# EAGLE design DevAndDemo (EAGLE 4.13)
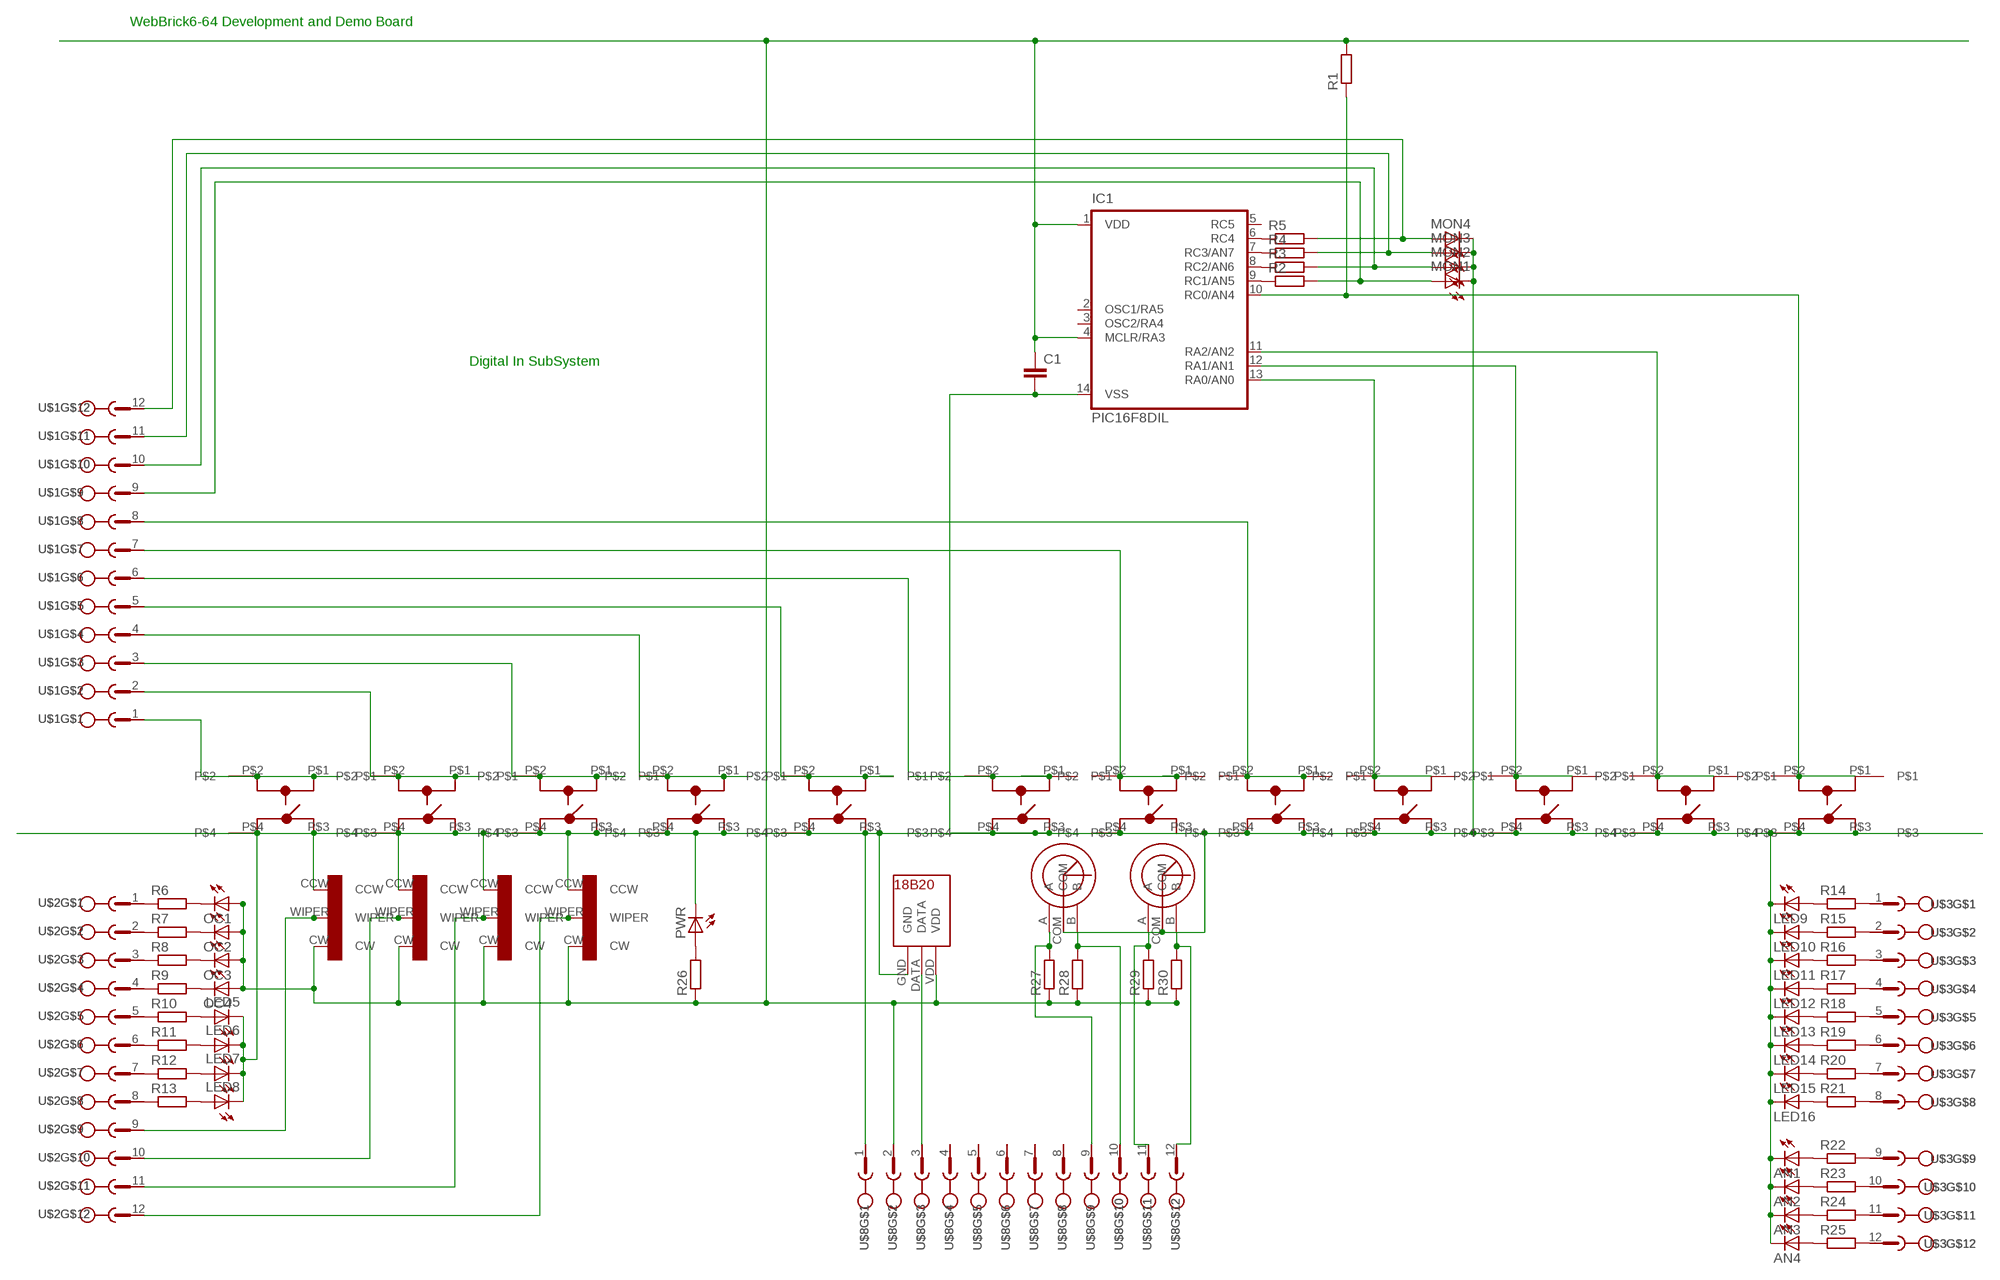
[diagram p0: schematic, sheet 1]

## Parts
AN1  LED5MM  [LED5MM]
AN2  LED5MM  [LED5MM]
AN3  LED5MM  [LED5MM]
AN4  LED5MM  [LED5MM]
ANO1  VISHAY174  [174]
ANO2  VISHAY174  [174]
ANO3  VISHAY174  [174]
ANO4  VISHAY174  [174]
C1  C-EUC1206  [C1206]
IC1  PIC16F8DIL  [DIL14]
LED5  LED5MM  [LED5MM]
LED6  LED5MM  [LED5MM]
LED7  LED5MM  [LED5MM]
LED8  LED5MM  [LED5MM]
LED9  LED5MM  [LED5MM]
LED10  LED5MM  [LED5MM]
LED11  LED5MM  [LED5MM]
LED12  LED5MM  [LED5MM]
LED13  LED5MM  [LED5MM]
LED14  LED5MM  [LED5MM]
LED15  LED5MM  [LED5MM]
LED16  LED5MM  [LED5MM]
MON1  LED5MM  [LED5MM]
MON2  LED5MM  [LED5MM]
MON3  LED5MM  [LED5MM]
MON4  LED5MM  [LED5MM]
OC1  LED5MM  [LED5MM]
OC2  LED5MM  [LED5MM]
OC3  LED5MM  [LED5MM]
OC4  LED5MM  [LED5MM]
PB1  3FSWITCH  [3F]
PB2  3FSWITCH  [3F]
PB3  3FSWITCH  [3F]
PB4  3FSWITCH  [3F]
PB5  3FSWITCH  [3F]
PB6  3FSWITCH  [3F]
PB7  3FSWITCH  [3F]
PB8  3FSWITCH  [3F]
PB9  3FSWITCH  [3F]
PB10  3FSWITCH  [3F]
PB11  3FSWITCH  [3F]
PB12  3FSWITCH  [3F]
PWR  LED5MM  [LED5MM]
R1  R-EU_M1206  [M1206]
R2  R-EU_M1206  [M1206]
R3  R-EU_M1206  [M1206]
R4  R-EU_M1206  [M1206]
R5  R-EU_M1206  [M1206]
R6  R-EU_M1206  [M1206]
R7  R-EU_M1206  [M1206]
R8  R-EU_M1206  [M1206]
R9  R-EU_M1206  [M1206]
R10  R-EU_M1206  [M1206]
R11  R-EU_M1206  [M1206]
R12  R-EU_M1206  [M1206]
R13  R-EU_M1206  [M1206]
R14  R-EU_M1206  [M1206]
R15  R-EU_M1206  [M1206]
R16  R-EU_M1206  [M1206]
R17  R-EU_M1206  [M1206]
R18  R-EU_M1206  [M1206]
R19  R-EU_M1206  [M1206]
R20  R-EU_M1206  [M1206]
R21  R-EU_M1206  [M1206]
R22  R-EU_M1206  [M1206]
R23  R-EU_M1206  [M1206]
R24  R-EU_M1206  [M1206]
R25  R-EU_M1206  [M1206]
R26  R-EU_M1206  [M1206]
R27  R-EU_M1206  [M1206]
R28  R-EU_M1206  [M1206]
R29  R-EU_M1206  [M1206]
R30  R-EU_M1206  [M1206]
ROT1  ROTARYENCODER  [ECW]
ROT2  ROTARYENCODER  [ECW]
U$1  MC123.5PITCH  [MC12-3.5]
U$2  MC123.5PITCH  [MC12-3.5]
U$3  MC123.5PITCH  [MC12-3.5]
U$8  MC123.5PITCH  [MC12-3.5]
U$11  18B20  [18B20]

## Nets
GND: AN1.K(C) AN2.K(C) AN3.K(C) AN4.K(C) ANO1.CCW ANO2.CCW ANO3.CCW ANO4.CCW C1.2 IC1.14(VSS) LED5.K(C) LED6.K(C) LED7.K(C) LED8.K(C) LED9.K(C) LED10.K(C) LED11.K(C) LED12.K(C) LED13.K(C) LED14.K(C) LED15.K(C) LED16.K(C) MON1.K(C) MON2.K(C) MON3.K(C) MON4.K(C) PB1.P$3 PB1.P$4 PB2.P$3 PB2.P$4 PB3.P$3 PB3.P$4 PB4.P$3 PB4.P$4 PB5.P$3 PB5.P$4 PB6.P$3 PB6.P$4 PB7.P$3 PB7.P$4 PB8.P$3 PB8.P$4 PB9.P$3 PB9.P$4 PB10.P$3 PB10.P$4 PB11.P$3 PB11.P$4 PB12.P$3 PB12.P$4 PWR.K(C) ROT1.COM ROT2.COM U$8.1 U$11.GND
N$1: PB1.P$1 PB1.P$2 U$1.1
N$2: PB2.P$1 PB2.P$2 U$1.2
N$3: PB3.P$1 PB3.P$2 U$1.3
N$4: PB4.P$1 PB4.P$2 U$1.4
N$5: PB5.P$1 PB5.P$2 U$1.5
N$6: PB6.P$1 PB6.P$2 U$1.6
N$7: PB7.P$1 PB7.P$2 U$1.7
N$8: PB8.P$1 PB8.P$2 U$1.8
N$9: IC1.13(RA0/AN0) PB9.P$1 PB9.P$2
N$10: IC1.12(RA1/AN1) PB10.P$1 PB10.P$2
N$11: IC1.11(RA2/AN2) PB11.P$1 PB11.P$2
N$12: IC1.10(RC0/AN4) PB12.P$1 PB12.P$2 R1.1
N$13: R6.1 U$2.1
N$14: IC1.9(RC1/AN5) R2.1
N$15: IC1.8(RC2/AN6) R3.1
N$16: IC1.7(RC3/AN7) R4.1
N$17: IC1.6(RC4) R5.1
N$18: MON4.A R5.2 U$1.12
N$19: MON3.A R4.2 U$1.11
N$20: MON2.A R3.2 U$1.10
N$21: MON1.A R2.2 U$1.9
N$22: R7.1 U$2.2
N$23: R8.1 U$2.3
N$24: R9.1 U$2.4
N$25: R10.1 U$2.5
N$26: R11.1 U$2.6
N$27: R12.1 U$2.7
N$28: R13.1 U$2.8
N$29: R14.2 U$3.1
N$30: R15.2 U$3.2
N$31: R16.2 U$3.3
N$32: R17.2 U$3.4
N$33: R18.2 U$3.5
N$34: R19.2 U$3.6
N$35: R20.2 U$3.7
N$36: R22.2 U$3.9
N$37: R23.2 U$3.10
N$38: R24.2 U$3.11
N$39: R25.2 U$3.12
N$40: R21.2 U$3.8
N$41: OC1.K(C) R6.2
N$42: OC2.K(C) R7.2
N$43: OC3.K(C) R8.2
N$44: OC4.K(C) R9.2
N$45: LED5.A R10.2
N$46: LED6.A R11.2
N$47: LED7.A R12.2
N$48: LED8.A R13.2
N$49: LED9.A R14.1
N$50: LED10.A R15.1
N$51: LED11.A R16.1
N$52: LED12.A R17.1
N$53: LED13.A R18.1
N$54: LED14.A R19.1
N$55: LED15.A R20.1
N$56: LED16.A R21.1
N$57: AN1.A R22.1
N$58: AN2.A R23.1
N$59: AN3.A R24.1
N$60: AN4.A R25.1
N$61: R27.2 ROT1.A U$8.9
N$62: ANO1.WIPER U$2.9
N$63: ANO2.WIPER U$2.10
N$64: ANO3.WIPER U$2.11
N$65: ANO4.WIPER U$2.12
N$66: PWR.A R26.2
N$67: R28.2 ROT1.B U$8.10
N$68: R29.2 ROT2.A U$8.11
N$69: R30.2 ROT2.B U$8.12
N$70: U$8.3 U$11.DATA
VDD: ANO1.CW ANO2.CW ANO3.CW ANO4.CW C1.1 IC1.1(VDD) IC1.4(MCLR/RA3) OC1.A OC2.A OC3.A OC4.A R1.2 R26.1 R27.1 R28.1 R29.1 R30.1 U$8.2 U$11.VDD
Unconnected: IC1.2(OSC1/RA5) IC1.3(OSC2/RA4) IC1.5(RC5) U$8.4 U$8.5 U$8.6 U$8.7 U$8.8

## Notes on the sheet
- WebBrick6-64 Development and Demo Board
- Digital In SubSystem

## Library data of the parts
AN1-AN4 LED5-LED16 MON1-MON4 OC1-OC4 PWR = led:LED: LED OSRAM: - CHIPLED LG R971, LG N971, LY N971, LG Q971, LY Q971, LO R971, LY R971 LH N974, LH R974 LS Q976, LO Q976, LY Q976 LO Q996 - Hyper CHIPLED LW Q18S LB Q993, LB Q99A, LB R99A - SideLED LS A670, LO A670, LY A670, LG A670, LP A670 LB A673, LV A673, LT A673, LW A673 LH A674 LY A675 LS A676, LA A676, LO A676, LY A676, LW A676 LS A679, LY A679, LG A679 - Hyper Micro SIDELED® LS Y876, LA Y876, LO Y876, LY Y876 LT Y87S - SmartLED LW L88C, LW L88S LB L89C, LB L89S, LG L890 LS L89K, LO L89K, LY L89K LS L896, LA L896, LO L896, LY L896 - TOPLED LS T670, LO T670, LY T670, LG T670, LP T670 LSG T670, LSP T670, LSY T670, LOP T670, LYG T670 LG T671, LOG T671, LSG T671 LB T673, LV T673, LT T673, LW T673 LH T674 LS T676, LA T676, LO T676, LY T676, LB T676, LH T676, LSB T676, LW T676 LB T67C, LV T67C, LT T67C, LS T67K, LO T67K, LY T67K, LW E67C LS E67B, LA E67B, LO E67B, LY E67B, LB E67C, LV E67C, LT E67C LW T67C LS T679, LY T679, LG T679 LS T770, LO T770, LY T770, LG T770, LP T770 LB T773, LV T773, LT T773, LW T773 LH T774 LS E675, LA E675, LY E675, LS T675 LS T776, LA T776, LO T776, LY T776, LB T776 LHGB T686 LT T68C, LB T68C - Hyper Mini TOPLED® LB M676 - Mini TOPLED Santana® LG M470 LS M47K, LO M47K, LY M47K Source: http://www.osram.convergy.de/
ANO1-ANO4 = vishay:VISHAY174
C1 = rcl:C-EU: CAPACITOR, European symbol
IC1 = pic16f6xx_14pin:PIC16F8*: MICROCONTROLLER 14-Pin, 8-Bit PIC16F8X Family - CMOS Flash Pin Compatible : 16F630, 16F676, 16F684, 16F688 Keywords: PIC16F630, PIC16F676, PIC16F684, PIC16F688
PB1-PB12 = Multimec:3FSWITCH
R1-R30 = rcl:R-EU_: RESISTOR, European symbol
ROT1 ROT2 = bourns:ROTARYENCODER
U$1-U$3 U$8 = con-phoenix-381_l:MC12
U$11 = 1WTempSensor:18B20

## Board
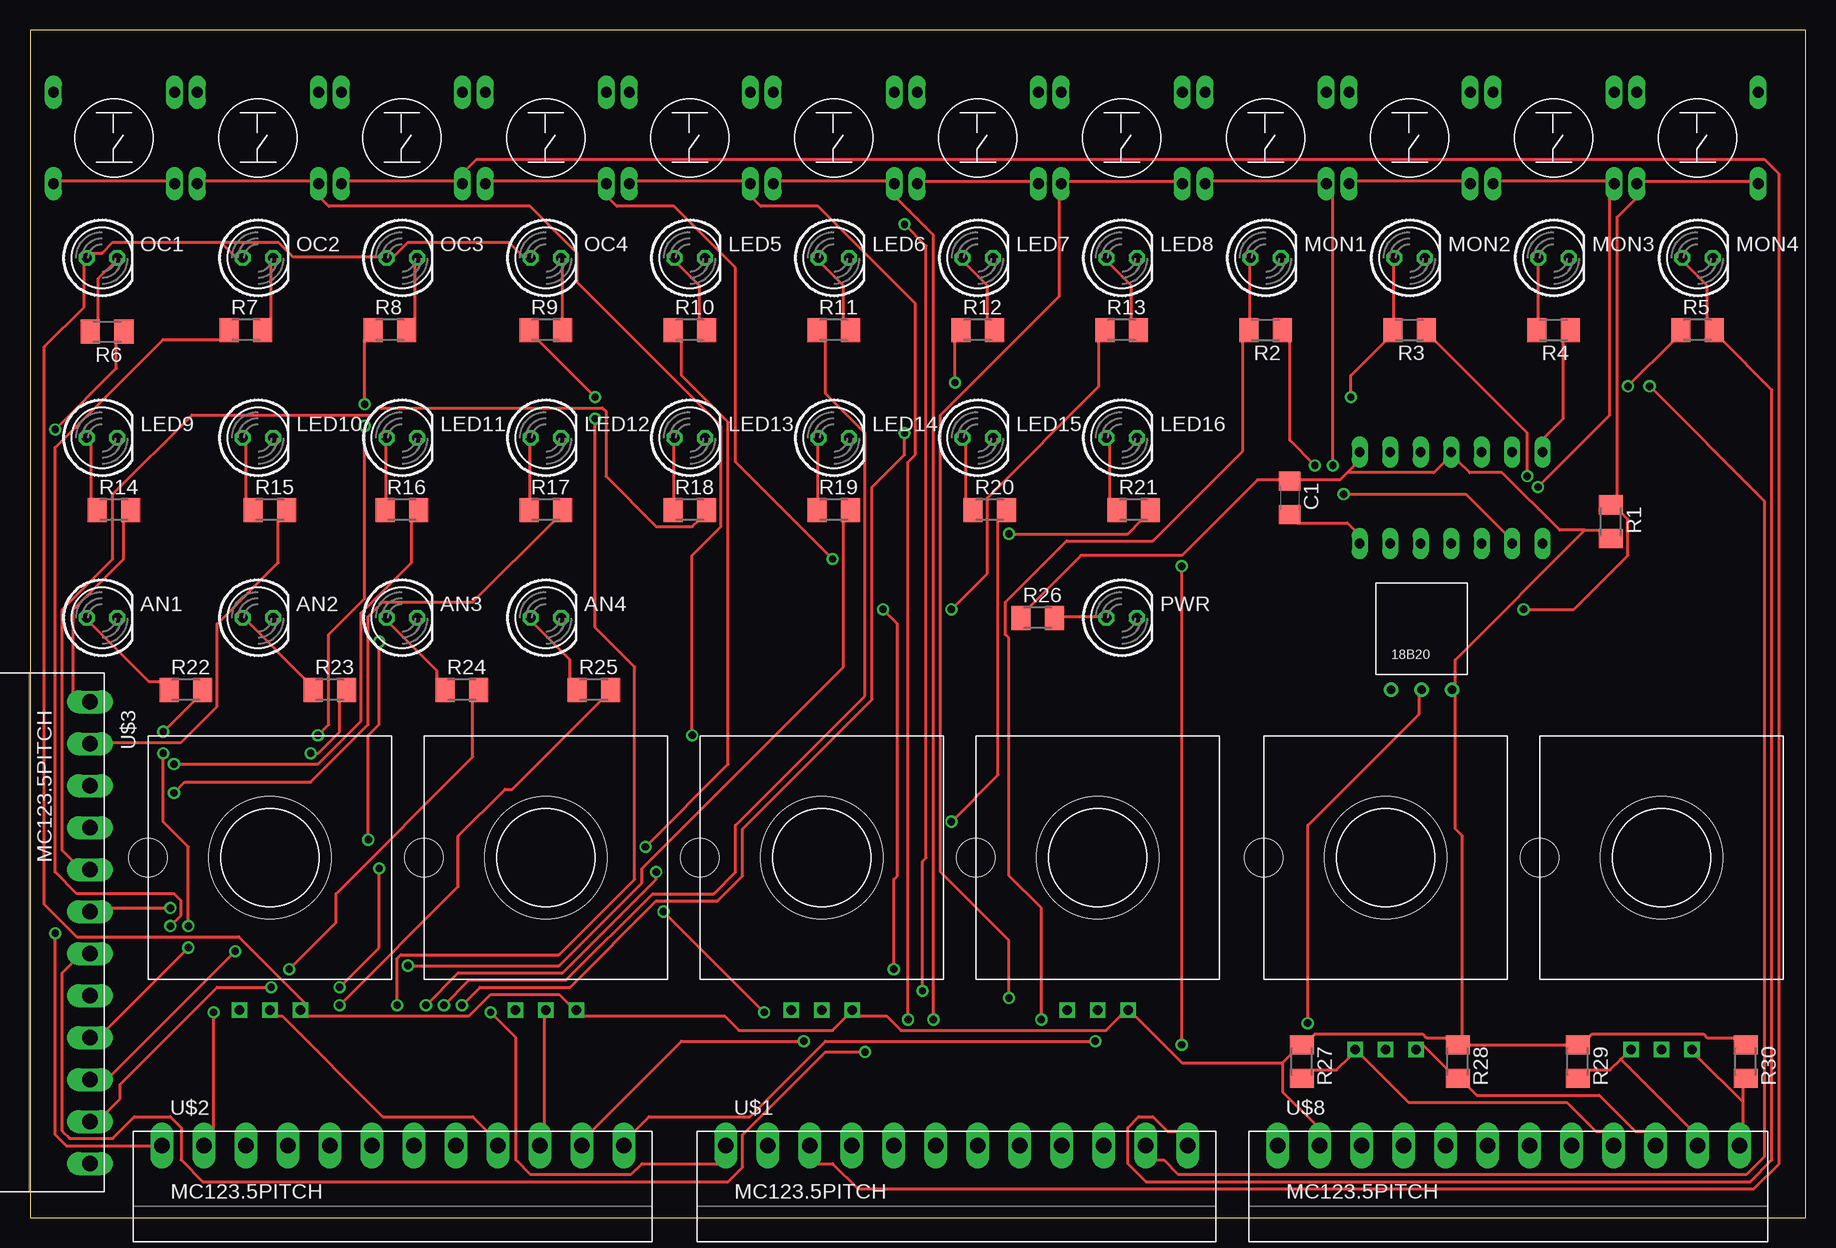
[diagram p1: board, top side]
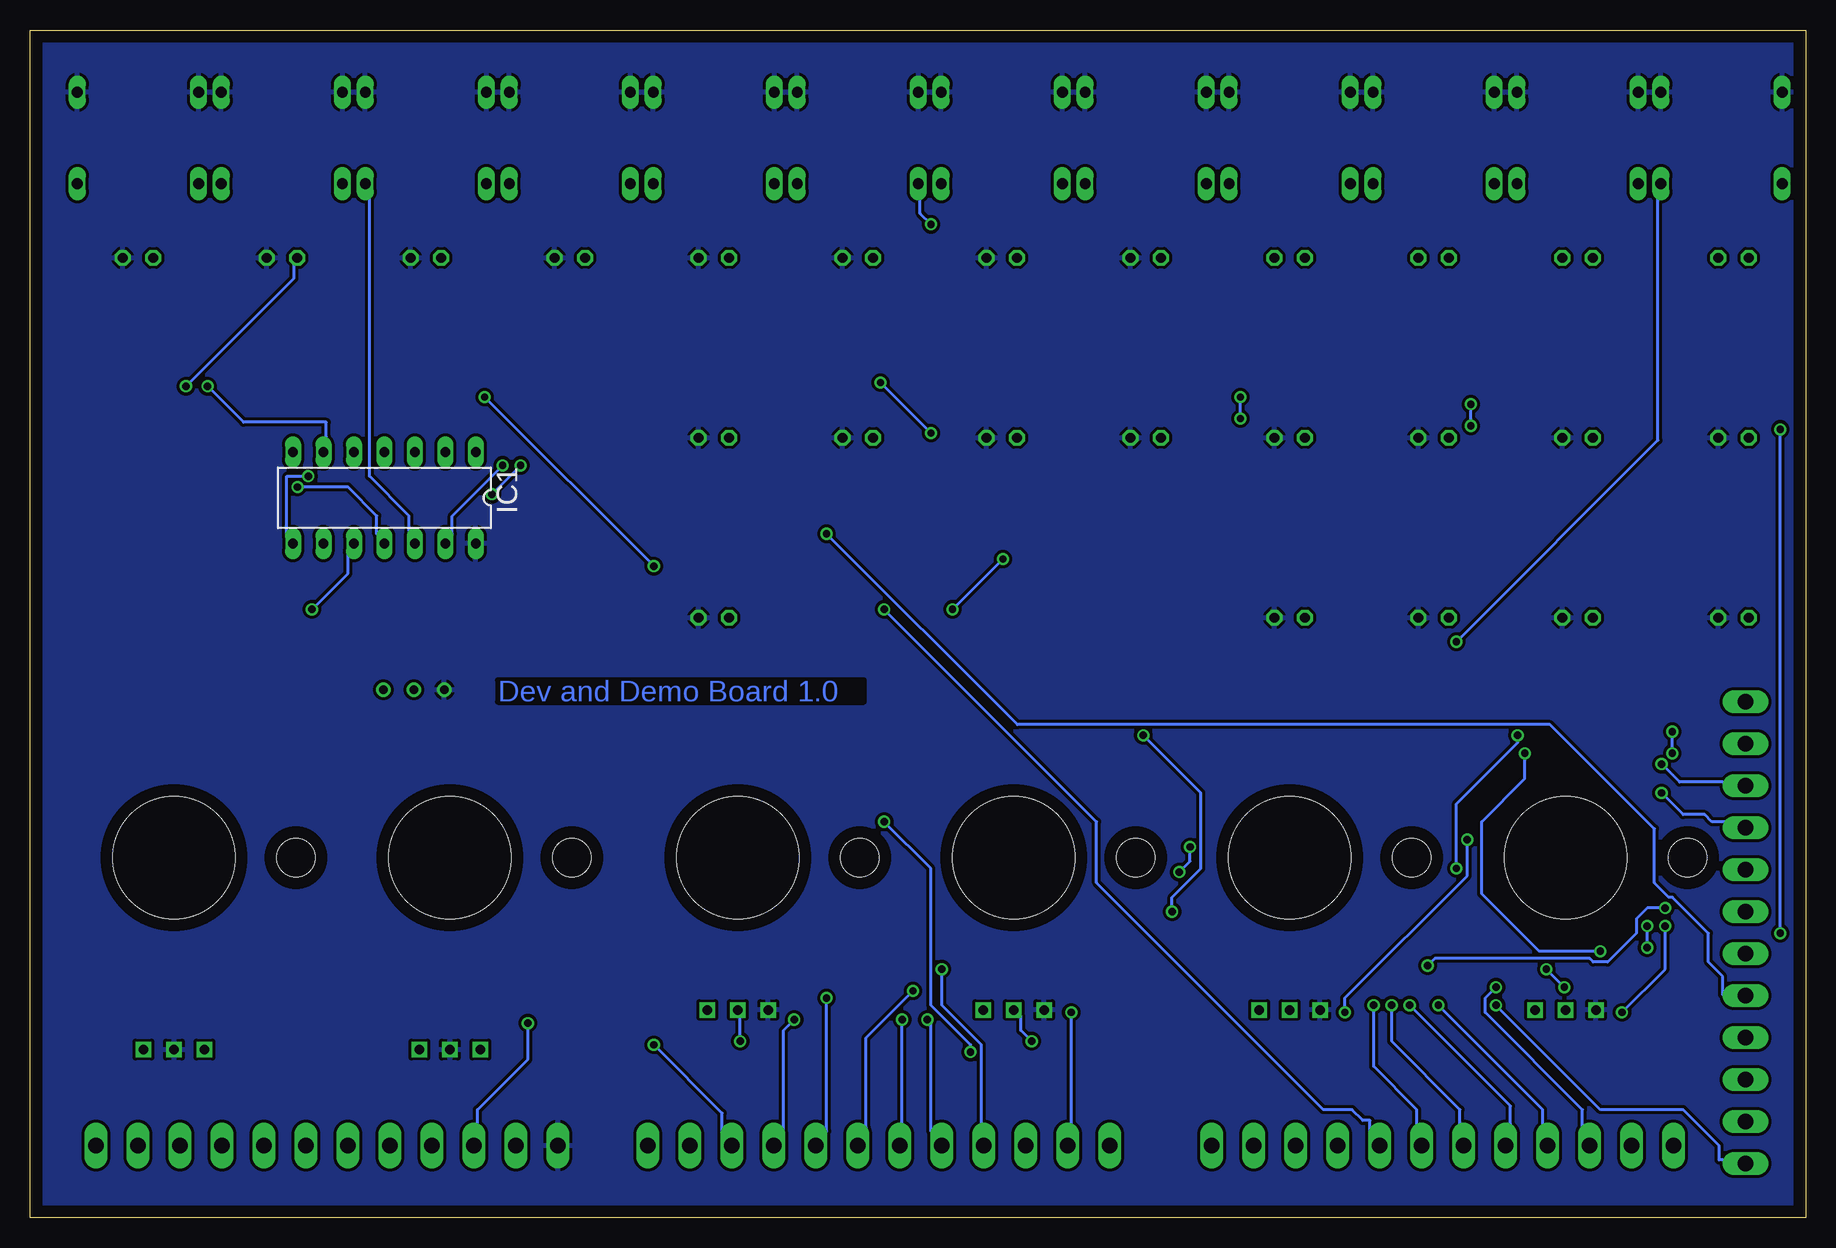
[diagram p2: board, bottom side, seen from below]

Size 148 x 99 mm. Coordinates in mm from the lower left corner, seen from the top.
Outline: 0,0 148,0 148,99 0,99 0,0
Copper layers (1*16): Top 0.035mm / dielectric 1.5mm / Bottom 0.035mm
Design rules "default": minimum track width 10mil, minimum drill 24mil, track to track 10mil, track to pad 10mil, pad to pad 10mil, via to via 10mil, smd to smd 10mil, copper to edge 40mil, drill to drill 8mil, minimum pad ring 10mil, minimum via ring 8mil, stop-mask expansion 4mil, vias tented up to drill 0mil, thermal gap 10mil

### Footprints (pad centres in the part's own frame; a part is rotated, then mirrored left to right if it is on the bottom)
LED5MM = drill 0.813 octagon: A -1.27,0; K 1.27,0
174 = drill 0.8 square: CCW -2.54,-12.7; CW 2.54,-12.7; WIPER 0,-12.7 | hole 3.2: -10.16,0 | hole 10.16: 0,0
C1206 = smd 1.6 x 1.8: 1 -1.4,0; 2 1.4,0
DIL14 = drill 0.813 long: 1 -10.16,-3.81; 2 -7.62,-3.81; 3 -5.08,-3.81; 4 -2.54,-3.81; 5 0,-3.81; 6 2.54,-3.81; 7 5.08,-3.81; 8 5.08,3.81; 9 2.54,3.81; 10 0,3.81; 11 -2.54,3.81; 12 -5.08,3.81; 13 -7.62,3.81; 14 -10.16,3.81
3F = drill 0.9 long: P$1 -5.05,-3.81; P$2 5.05,-3.81; P$3 5.05,3.81; P$4 -5.05,3.81
M1206 = smd 1.6 x 2: 1 -1.4,0; 2 1.4,0
ECW = drill 0.8 square: A -2.54,-16.002; B 2.54,-16.002; COM 0,-16.002 | hole 10.16: 0,0 | hole 3.2: -10.16,0
MC12-3.5 = drill 1.27 long: 1 -21,0; 2 -17.5,0; 3 -14,0; 4 -10.5,0; 5 -7,0; 6 -3.5,0; 7 0,0; 8 3.5,0; 9 7,0; 10 10.5,0; 11 14,0; 12 17.5,0
18B20 = drill 0.7 pad 1.016 round: DATA 0,0; GND -2.54,0; VDD 2.54,0

### Placement (x,y rotation side)
AN1  6,50 0 top
AN2  19,50 0 top
AN3  31,50 0 top
AN4  43,50 0 top
ANO1  20,30 0 top
ANO2  43,30 0 top
ANO3  66,30 0 top
ANO4  89,30 0 top
C1  105,60 270 top
IC1  121,60 180 bottom
LED5  55,80 0 top
LED6  67,80 0 top
LED7  79,80 0 top
LED8  91,80 0 top
LED9  6,65 0 top
LED10  19,65 0 top
LED11  31,65 0 top
LED12  43,65 0 top
LED13  55,65 0 top
LED14  67,65 0 top
LED15  79,65 0 top
LED16  91,65 0 top
MON1  103,80 0 top
MON2  115,80 0 top
MON3  127,80 0 top
MON4  139,80 0 top
OC1  6,80 0 top
OC2  19,80 0 top
OC3  31,80 0 top
OC4  43,80 0 top
PB1  7,90 0 top
PB2  19,90 0 top
PB3  31,90 0 top
PB4  43,90 0 top
PB5  55,90 0 top
PB6  67,90 0 top
PB7  79,90 0 top
PB8  91,90 0 top
PB9  103,90 0 top
PB10  115,90 0 top
PB11  127,90 0 top
PB12  139,90 0 top
PWR  91,50 0 top
R1  131.78,58.01 270 top
R2  103,74 180 top
R3  115,74 180 top
R4  127,74 180 top
R5  139,74 0 top
R6  6.43,73.85 180 top
R7  18,74 0 top
R8  30,74 0 top
R9  43,74 0 top
R10  55,74 0 top
R11  67,74 0 top
R12  79,74 0 top
R13  91,74 0 top
R14  7,59 0 top
R15  20,59 0 top
R16  31,59 0 top
R17  43,59 0 top
R18  55,59 0 top
R19  67,59 0 top
R20  80,59 0 top
R21  92,59 0 top
R22  13,44 0 top
R23  25,44 0 top
R24  36,44 0 top
R25  47,44 0 top
R26  84,50 0 top
R27  106,13 270 top
R28  119,13 270 top
R29  129,13 270 top
R30  143,13 270 top
ROT1  113,30 0 top
ROT2  136,30 0 top
U$1  79,6 0 top
U$2  32,6 0 top
U$3  5,22 270 top
U$8  125,6 0 top
U$11  116,44 0 top

### Tracks (layer width: path | path; a pad name or v marks a point on that pad's centre or on a via)
GND
  Top 0.254: C1.2 105.6,57.9 109.8,57.9 110.4,57.3 IC1.14
  pour Bottom: 1,98 147,98 147,1 1,1
N$1  (via drill 0.61)
  Top 0.254: PB1.P$1 2.4,86.4 11.4,86.4 PB1.P$2 | v38.4,17.1 40.5,15 40.5,4.8 41.7,3.6 50.1,3.6 51,4.5 57.3,4.5 U$1.1 | v28.2,31.5 28.2,40.2 29.1,41.1 v29.1,48
  Bottom 0.254: v38.4,17.1 38.4,18.3 28.2,28.5 v28.2,31.5 | v29.1,48 12.3,64.8 12.3,84.9 PB1.P$2
N$2  (via drill 0.61)
  Top 0.254: PB2.P$1 14.4,86.4 23.4,86.4 PB2.P$2 24.3,84.9 24.9,84.3 41.7,84.3 45.6,80.4 45.6,78 57.6,66 57.6,57.6 55.2,55.2 v55.2,40.2 | v61.2,17.1 v52.8,25.5
  Bottom 0.254: v61.2,17.1 61.2,7.8 U$1.2 | v52.8,25.5 52.8,26.7 50.4,29.1 50.4,35.4 v55.2,40.2
N$3
  Top 0.254: PB3.P$1 26.4,86.4 35.4,86.4 PB3.P$2 36.3,87.3 37.2,88.2 144.6,88.2 145.8,87 145.8,4.5 143.7,2.4 69,2.4 66.9,4.5 65.7,4.5 U$1.3
N$4  (via drill 0.61)
  Top 0.254: PB4.P$1 38.4,86.4 47.4,86.4 PB4.P$2 48.3,84.9 48.9,84.3 53.7,84.3 58.8,79.2 58.8,63 v66.9,54.9 | v72,20.7 72,28.2 72.3,28.5 72.3,49.5 v71.1,50.7
  Bottom 0.254: v72,20.7 72,17.7 68.7,14.4 68.7,7.8 U$1.4 | v71.1,50.7 v66.9,54.9
N$5  (via drill 0.61)
  Top 0.254: PB5.P$1 50.4,86.4 59.4,86.4 PB5.P$2 60.3,84.9 60.9,84.3 65.7,84.3 73.8,76.2 73.8,63.6 73.2,63 v73.2,16.5
  Bottom 0.254: v73.2,16.5 72.9,16.2 72.9,7.2 U$1.5
N$6  (via drill 0.61)
  Top 0.254: PB6.P$1 62.4,86.4 71.4,86.4 PB6.P$2 72.3,84.9 75.3,81.9 v75.3,16.5
  Bottom 0.254: v75.3,16.5 75.3,7.8 U$1.6
N$7  (via drill 0.61)
  Top 0.254: PB7.P$1 74.4,86.4 83.4,86.4 PB7.P$2 | v74.4,18.9 74.4,29.7 74.7,30 74.7,81 v72.9,82.8
  Bottom 0.254: v74.4,18.9 78.3,15 78.3,7.5 U$1.7 | v72.9,82.8 73.8,83.7 73.8,84.9 PB7.P$1
N$8  (via drill 0.61)
  Top 0.254: PB8.P$2 95.4,86.4 86.4,86.4 PB8.P$1 85.8,84.9 85.8,76.8 75.9,66.9 75.9,28.8 81.6,23.1 v81.6,18.3
  Bottom 0.254: v81.6,18.3 81.6,7.2 U$1.8
N$9  (via drill 0.61)
  Top 0.254: v108.6,62.7 108.6,85.2 PB9.P$2 107.4,86.4 98.4,86.4 PB9.P$1
  Bottom 0.254: v108.6,62.7 112.8,58.5 112.8,57 IC1.13
N$10
  Top 0.254: PB10.P$1 110.4,86.4 119.4,86.4 PB10.P$2
  Bottom 0.254: IC1.12 116.4,57.3 116.4,58.5 119.7,61.8 119.7,84.9 PB10.P$2
N$11  (via drill 0.61)
  Top 0.254: v125.7,60.9 131.7,66.9 131.7,84.9 PB11.P$2 131.4,86.4 122.4,86.4 PB11.P$1
  Bottom 0.254: v125.7,60.9 121.5,60.9 119.1,58.5 119.1,57 IC1.11
N$12  (via drill 0.61)
  Top 0.254: v124.5,50.7 128.7,50.7 133.2,55.2 133.2,58.2 132.6,58.8 R1.1 132.3,60 132.3,83.4 133.8,84.9 PB12.P$1 134.4,86.4 143.4,86.4 PB12.P$2
  Bottom 0.254: v124.5,50.7 121.5,53.7 121.5,55.2 IC1.10
N$13  (via drill 0.61)
  Top 0.254: v2.1,65.7 7.2,70.8 7.2,72.9 R6.1 | v2.1,23.7 2.1,6.9 3,6 U$2.1
  Bottom 0.254: v2.1,23.7 v2.1,65.7
N$14  (via drill 0.61)
  Top 0.254: v107.1,62.7 105,64.8 105,73.2 R2.1 | v109.5,60.3 119.7,60.3 123,57 IC1.9
  Bottom 0.254: v109.5,60.3 v107.1,62.7
N$15  (via drill 0.61)
  Top 0.254: v124.8,61.8 124.8,65.4 117,73.2 R3.1
  Bottom 0.254: v124.8,61.8 126.6,61.8 126.6,57 IC1.8
N$16
  Top 0.254: R4.1 127.8,73.2 127.8,66.6 126.3,65.1 IC1.7
N$17  (via drill 0.61)
  Top 0.254: v133.2,69.3 137.1,73.2 R5.1
  Bottom 0.254: v133.2,69.3 130.2,66.3 123.3,66.3 123.3,65.1 IC1.6
N$18
  Top 0.254: MON4.A 138,79.5 139.8,77.7 139.8,74.7 R5.2 141,73.2 145.2,69 145.2,4.8 143.4,3 93,3 91.5,4.5 91.5,7.5 92.4,8.4 93.6,8.4 94.8,7.2 95.7,7.2 U$1.12
N$19  (via drill 0.61)
  Top 0.254: R4.2 125.7,74.7 125.7,79.5 MON3.A | v135,69.3 144.6,59.7 144.6,5.1 143.1,3.6 95.7,3.6 94.5,4.8 93.9,4.8 U$1.11
  Bottom 0.254: v135,69.3 126,78.3 126,79.5 MON3.A
N$20  (via drill 0.61)
  Top 0.254: MON2.A 113.7,79.5 113.7,74.7 R3.2 113.1,73.2 110.1,70.2 v110.1,68.4 | v96,14.4 v96,54.3
  Bottom 0.254: v96,14.4 90.3,8.7 90.3,7.2 U$1.10 | v96,54.3 v110.1,68.4
N$21  (via drill 0.61)
  Top 0.254: MON1.A 101.7,79.5 101.7,74.7 R2.2 101.1,73.2 101.1,63.9 93.6,56.4 86.4,56.4 81.3,51.3 81.3,48.6 81.6,48.3 81.6,28.5 84.3,25.8 v84.3,16.5
  Bottom 0.254: v84.3,16.5 85.2,15.6 85.2,7.2 U$1.9
N$22  (via drill 0.61)
  Top 0.254: v11.7,24.3 12.6,25.2 12.6,26.4 12,27 3.9,27 2.1,28.8 2.1,64.2 11.1,73.2 15.9,73.2 R7.1 | v15.3,17.1 15.3,7.2 U$2.2
  Bottom 0.254: v11.7,24.3 11.7,20.7 v15.3,17.1
N$23  (via drill 0.61)
  Top 0.254: v27.9,67.8 27.9,73.2 R8.1 | v27.9,66 27.9,51.6 24.9,48.6 24.9,41.1 v24,40.2 | v29.1,29.1 29.1,22.5 v25.8,19.2
  Bottom 0.254: v27.9,66 v27.9,67.8 | v24,40.2 24,39.6 29.1,34.5 v29.1,29.1 | v25.8,19.2 26.7,18.3 26.7,17.1 18.6,9 18.6,7.5 U$2.3
N$24  (via drill 0.61)
  Top 0.254: v47.1,68.4 42.3,73.2 R9.1 | v47.1,66.6 47.1,49.2 50.4,45.9 50.4,28.2 44.1,21.9 30.9,21.9 30.6,21.6 v30.6,17.7
  Bottom 0.254: v47.1,66.6 v47.1,68.4 | v30.6,17.7 21.9,9 21.9,7.8 U$2.4
N$25  (via drill 0.61)
  Top 0.254: v51.3,30.9 58.2,37.8 58.2,66.3 54.3,70.2 54.3,73.2 R10.1 | v52.2,28.8 52.2,28.2 44.4,20.4 35.7,20.4 v33,17.7
  Bottom 0.254: v51.3,30.9 51.3,29.7 v52.2,28.8 | v33,17.7 24.6,9.3 24.6,7.8 U$2.5
N$26  (via drill 0.61)
  Top 0.254: v34.5,17.7 36.6,19.8 44.7,19.8 51.9,27 57,27 58.8,28.8 58.8,32.7 69.6,43.5 69.6,65.4 66.3,68.7 66.3,73.2 R11.1
  Bottom 0.254: v34.5,17.7 34.5,14.7 28.8,9 28.8,7.8 U$2.6
N$27  (via drill 0.61)
  Top 0.254: v77.1,69.6 77.1,73.2 R12.1 | v72.9,65.4 72.9,63.6 70.2,60.9 70.2,43.2 59.4,32.4 59.4,28.5 57.3,26.4 52.2,26.4 45,19.2 37.5,19.2 v36,17.7
  Bottom 0.254: v72.9,65.4 v77.1,69.6 | v36,17.7 36,12.6 32.4,9 32.4,7.8 U$2.7
N$28  (via drill 0.61)
  Top 0.254: v76.8,50.7 79.8,53.7 79.8,60 89.1,69.3 89.1,73.2 R13.1
  Bottom 0.254: v76.8,50.7 59.1,33 59.1,27.9 40.2,9 37.8,9 36.9,8.1 36.3,8.1 36.3,7.2 U$2.8
N$29
  Top 0.254: R14.2 7.8,58.2 7.8,54.9 3.6,50.7 3.6,43.8 U$3.1
N$30
  Top 0.254: R15.2 20.7,58.2 20.7,54.6 15.6,49.5 15.6,42.6 12.6,39.6 6.9,39.6 U$3.2
N$31  (via drill 0.61)
  Top 0.254: v12,37.8 24,37.8 27.6,41.4 27.6,50.4 31.8,54.6 31.8,58.2 R16.2
  Bottom 0.254: v12,37.8 10.5,36.3 6.9,36.3 U$3.3
N$32  (via drill 0.61)
  Top 0.254: v12,35.4 12.9,36.3 23.4,36.3 28.2,41.1 28.2,50.1 29.4,51.3 36.9,51.3 43.8,58.2 R17.2
  Bottom 0.254: v12,35.4 10.2,33.6 8.4,33.6 7.8,33 6.6,33 U$3.4
N$33
  Top 0.254: R18.2 55.8,58.2 55.2,57.6 52.2,57.6 48,61.8 48,67.2 47.7,67.5 29.1,67.5 28.5,66.9 13.5,66.9 6.9,60.3 6.9,54.9 2.7,50.7 2.7,30.6 3.6,29.7 U$3.5
N$34  (via drill 0.61)
  Top 0.254: v31.5,21 44.1,21 51,27.9 51,29.1 67.8,45.9 67.8,58.2 R19.2 | v11.7,25.8 6.9,25.8 U$3.6
  Bottom 0.254: v31.5,21 30.9,21.6 18,21.6 17.7,21.3 16.5,21.3 14.1,23.7 14.1,24.9 13.2,25.8 v11.7,25.8
N$35  (via drill 0.61)
  Top 0.254: v76.8,33 80.7,36.9 80.7,58.2 R20.2 | v69.6,13.8 66.3,13.8 59.4,6.9 59.4,4.2 58.2,3 14.4,3 12.6,4.8 12.6,7.5 11.7,8.4 8.7,8.4 6.9,6.6 3.3,6.6 2.7,7.2 2.7,20.4 3.6,21.3 U$3.7
  Bottom 0.254: v76.8,33 72.9,29.1 72.9,17.7 69.6,14.4 v69.6,13.8
N$36  (via drill 0.61)
  Top 0.254: v11.1,40.5 13.8,43.2 R22.2 | v11.1,38.7 11.1,33 13.2,30.9 v13.2,24.3 | v13.2,22.5 6.3,15.6 U$3.9
  Bottom 0.254: v11.1,38.7 v11.1,40.5 | v13.2,22.5 v13.2,24.3
N$37  (via drill 0.61)
  Top 0.254: v23.4,38.7 24,38.7 25.8,40.5 25.8,43.2 R23.2 | v17.1,22.2 6.6,11.7 U$3.10
  Bottom 0.254: v23.4,38.7 23.4,36.6 27,33 27,27 22.2,22.2 v17.1,22.2
N$38  (via drill 0.61)
  Top 0.254: v21.6,20.7 25.5,24.6 25.5,27 36.9,38.4 36.9,43.2 R24.2 | v20.1,19.2 15.6,19.2 7.5,11.1 7.5,9.9 6.3,8.7 U$3.11
  Bottom 0.254: v20.1,19.2 v21.6,20.7
N$39  (via drill 0.61)
  Top 0.254: v25.8,17.7 35.7,27.6 35.7,31.8 39.6,35.7 40.2,35.7 47.7,43.2 R25.2
  Bottom 0.254: v25.8,17.7 17.1,9 10.2,9 7.2,6 7.2,4.8 6.9,4.8 U$3.12
N$40  (via drill 0.61)
  Top 0.254: v81.6,57 91.5,57 92.7,58.2 R21.2
  Bottom 0.254: v81.6,57 65.7,41.1 21.3,41.1 12.6,32.4 12.6,27.9 11.4,26.7 11.1,26.7 8.1,23.7 8.1,21.3 6.9,20.1 6.9,18.6 U$3.8
N$41
  Top 0.254: R6.2 5.7,74.7 5.7,78.3 6.9,79.5 OC1.K
N$42
  Top 0.254: R7.2 20.1,74.7 20.1,79.5 OC2.K
N$43
  Top 0.254: R8.2 32.1,74.7 32.1,79.5 OC3.K
N$44
  Top 0.254: R9.2 44.4,79.5 OC4.K
N$45
  Top 0.254: R10.2 55.8,74.7 55.8,77.7 54,79.5 LED5.A
N$46
  Top 0.254: R11.2 67.8,74.7 67.8,77.7 66,79.5 LED6.A
N$47
  Top 0.254: R12.2 79.8,74.7 79.8,77.7 78,79.5 LED7.A
N$48
  Top 0.254: R13.2 91.8,74.7 91.8,77.7 90,79.5 LED8.A
N$49
  Top 0.254: R14.1 5.1,59.7 5.1,64.5 LED9.A
N$50
  Top 0.254: R15.1 18,59.7 18,64.5 LED10.A
N$51
  Top 0.254: R16.1 29.7,59.7 29.7,64.5 LED11.A
N$52
  Top 0.254: R17.1 41.7,59.7 41.7,64.5 LED12.A
N$53
  Top 0.254: R18.1 53.7,59.7 53.7,64.5 LED13.A
N$54
  Top 0.254: R19.1 65.7,59.7 65.7,64.5 LED14.A
N$55
  Top 0.254: R20.1 78,59.7 78,64.5 LED15.A
N$56
  Top 0.254: R21.1 90,59.7 90,64.5 LED16.A
N$57
  Top 0.254: R22.1 11.1,44.7 9.9,44.7 5.1,49.5 AN1.A
N$58
  Top 0.254: R23.1 23.1,44.7 18,49.8 AN2.A
N$59
  Top 0.254: R24.1 33.9,44.7 33.9,45.6 30,49.5 AN3.A
N$60
  Top 0.254: R25.1 45,44.7 45,46.5 42,49.5 AN4.A
N$61
  Top 0.254: R27.2 106.8,12.3 108.9,12.3 110.1,13.5 ROT1.A 111,13.5 114.9,9.6 128.1,9.6 130.5,7.2 131.1,7.2 U$8.9
N$62
  Top 0.254: ANO1.WIPER 20.4,16.8 21,16.8 29.4,8.4 36.9,8.4 38.1,7.2 U$2.9
N$63
  Top 0.254: ANO2.WIPER 42.9,16.8 42.9,7.8 U$2.10
N$64  (via drill 0.61)
  Top 0.254: v64.5,14.7 54.3,14.7 46.8,7.2 U$2.11
  Bottom 0.254: v64.5,14.7 65.4,15.6 65.4,16.8 ANO3.WIPER
N$65  (via drill 0.61)
  Top 0.254: v88.8,14.7 66.3,14.7 60,8.4 51.6,8.4 50.4,7.2 U$2.12
  Bottom 0.254: v88.8,14.7 88.8,16.8 ANO4.WIPER
N$66
  Top 0.254: R26.2 86.1,50.1 89.1,50.1 PWR.A
N$67
  Top 0.254: ROT1.B 116.1,14.4 118.2,12.3 R28.2 119.7,11.1 120.6,10.2 130.8,10.2 133.8,7.2 134.7,7.2 U$8.10
N$68
  Top 0.254: 132.6,13.2 132.9,13.5 ROT2.A | 132.6,13.2 131.7,12.3 129.9,12.3 R29.2 | 132.6,13.2 138.3,7.5 U$8.11
N$69
  Top 0.254: 142.8,9.6 142.8,7.8 U$8.12 | 142.8,9.6 142.8,11.1 R30.2 | 142.8,9.6 138.9,13.5 ROT2.B
N$70  (via drill 0.61)
  Top 0.254: v106.5,16.2 106.5,32.7 115.8,42 115.8,43.5 U$11.DATA
  Bottom 0.254: v106.5,16.2 106.5,13.2 110.7,9 110.7,7.8 U$8.3
VDD
  Top 0.254: 129.6,57.3 127.5,57.3 122.7,62.1 120,62.1 119.1,63 IC1.4 117.9,63 117,62.1 109.8,62.1 | 129.6,57.3 130.8,57.3 R1.2 | 129.6,57.3 118.8,46.5 118.8,44.4 U$11.VDD 118.8,43.5 118.8,32.4 119.4,31.8 119.4,15 R28.1 | 109.8,62.1 110.4,62.7 IC1.1 | 109.8,62.1 109.2,61.5 105.6,61.5 C1.1 104.4,61.5 102.3,61.5 96,55.2 87.6,55.2 83.1,50.7 R26.1 | OC4.A 41.1,80.1 39.9,81.3 31.5,81.3 30.3,80.1 OC3.A 29.1,80.1 21.9,80.1 20.7,81.3 15.9,81.3 | 15.9,81.3 6.9,81.3 6,80.4 5.1,80.4 OC1.A 4.5,79.5 4.5,75.9 1.2,72.6 1.2,26.1 3.9,23.4 17.4,23.4 23.1,17.7 ANO1.CW 23.1,16.8 36.6,16.8 38.4,18.6 44.1,18.6 45,17.7 ANO2.CW 45.9,16.8 57.9,16.8 59.1,15.6 66.9,15.6 68.1,16.8 ANO3.CW 69,16.8 71.4,16.8 72.6,15.6 89.7,15.6 90.9,16.8 ANO4.CW 92.1,16.8 96,12.9 104.4,12.9 | 15.9,81.3 17.1,80.1 OC2.A | R28.1 R29.1 129.9,15 130.2,15.3 139.5,15.3 139.8,15 142.2,15 R30.1 | 104.4,12.9 105.3,13.8 R27.1 106.8,15 107.1,15.3 116.1,15.3 116.4,15 118.2,15 R28.1 | 104.4,12.9 104.4,10.5 107.1,7.8 U$8.2

### Text on the board
Bottom: Dev and Demo Board 1.0